# Altium schematic sheet CLK_PWR.SchDoc: My title
size A3; Organization: University of California; Address1: 475 Portola Plaza; Address2: Los Angeles, CA 90095; DocumentNumber: 12; Revision: R01; SheetNumber: 12; SheetTotal: 35
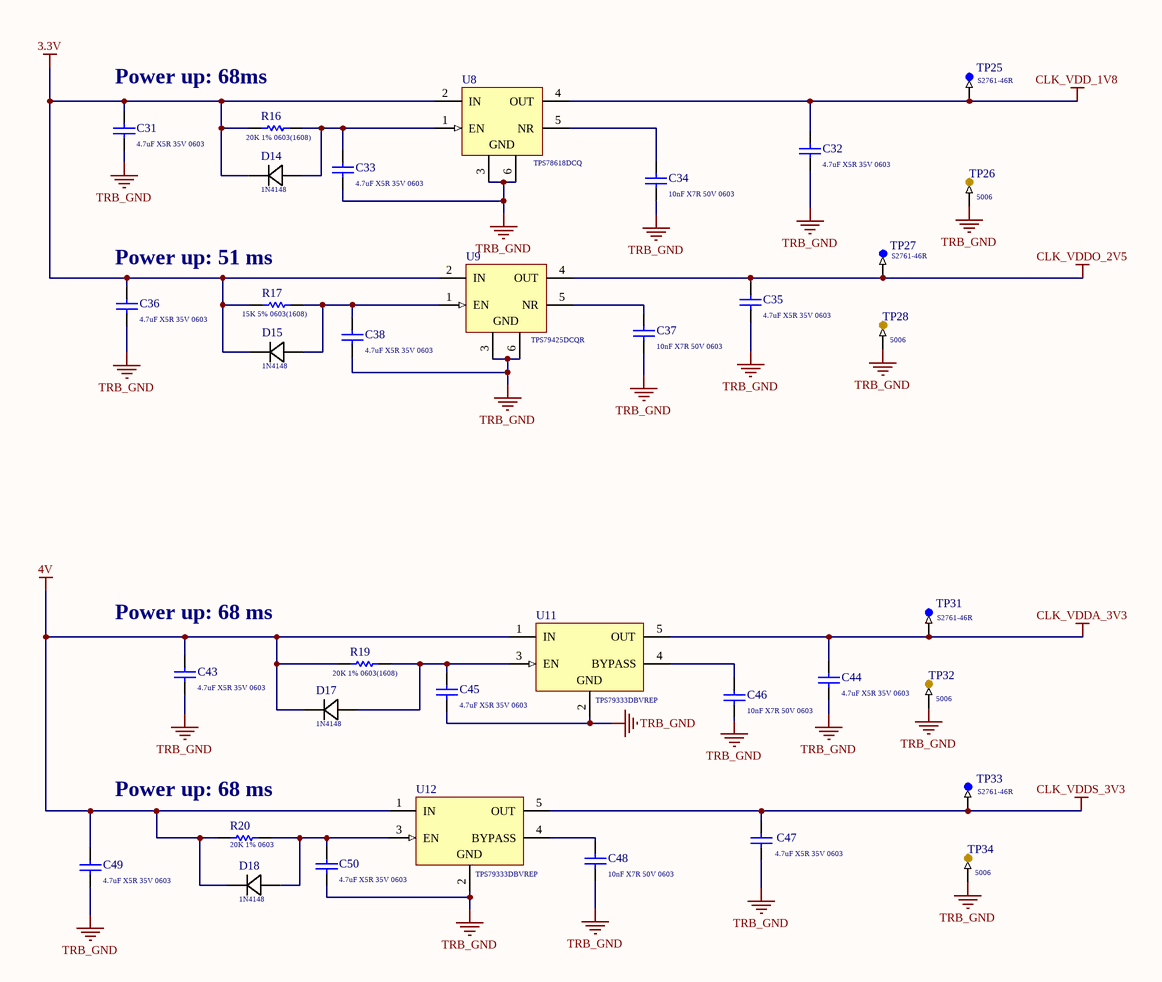
[diagram p0: CLK_PWR.SchDoc]

## Parts
C31  Capacitance: 4.7uF X5R 35V 0603  [Cap_Murata_ZRB18AR6YA475ME05L_4.7uF]  (hidden comment: Cap_Murata_ZRB18AR6YA475ME05L_4.7uF)
C32  Capacitance: 4.7uF X5R 35V 0603  [Cap_Murata_ZRB18AR6YA475ME05L_4.7uF]  (hidden comment: Cap_Murata_ZRB18AR6YA475ME05L_4.7uF)
C33  Capacitance: 4.7uF X5R 35V 0603  [Cap_Murata_ZRB18AR6YA475ME05L_4.7uF]  (hidden comment: Cap_Murata_ZRB18AR6YA475ME05L_4.7uF)
C34  Capacitance: 10nF X7R 50V 0603  [Kemet_C0603_0]  (hidden comment: Cap_Kemet_C0603C103J5RACTU_eec)
C35  Capacitance: 4.7uF X5R 35V 0603  [Cap_Murata_ZRB18AR6YA475ME05L_4.7uF]  (hidden comment: Cap_Murata_ZRB18AR6YA475ME05L_4.7uF)
C36  Capacitance: 4.7uF X5R 35V 0603  [Cap_Murata_ZRB18AR6YA475ME05L_4.7uF]  (hidden comment: Cap_Murata_ZRB18AR6YA475ME05L_4.7uF)
C37  Capacitance: 10nF X7R 50V 0603  [Kemet_C0603_0]  (hidden comment: Cap_Kemet_C0603C103J5RACTU_eec)
C38  Capacitance: 4.7uF X5R 35V 0603  [Cap_Murata_ZRB18AR6YA475ME05L_4.7uF]  (hidden comment: Cap_Murata_ZRB18AR6YA475ME05L_4.7uF)
C43  Capacitance: 4.7uF X5R 35V 0603  [Cap_Murata_ZRB18AR6YA475ME05L_4.7uF]  (hidden comment: Cap_Murata_ZRB18AR6YA475ME05L_4.7uF)
C44  Capacitance: 4.7uF X5R 35V 0603  [Cap_Murata_ZRB18AR6YA475ME05L_4.7uF]  (hidden comment: Cap_Murata_ZRB18AR6YA475ME05L_4.7uF)
C45  Capacitance: 4.7uF X5R 35V 0603  [Cap_Murata_ZRB18AR6YA475ME05L_4.7uF]  (hidden comment: Cap_Murata_ZRB18AR6YA475ME05L_4.7uF)
C46  Capacitance: 10nF X7R 50V 0603  [Kemet_C0603_0]  (hidden comment: Cap_Kemet_C0603C103J5RACTU_eec)
C47  Capacitance: 4.7uF X5R 35V 0603  [Cap_Murata_ZRB18AR6YA475ME05L_4.7uF]  (hidden comment: Cap_Murata_ZRB18AR6YA475ME05L_4.7uF)
C48  Capacitance: 10nF X7R 50V 0603  [Kemet_C0603_0]  (hidden comment: Cap_Kemet_C0603C103J5RACTU_eec)
C49  Capacitance: 4.7uF X5R 35V 0603  [Cap_Murata_ZRB18AR6YA475ME05L_4.7uF]  (hidden comment: Cap_Murata_ZRB18AR6YA475ME05L_4.7uF)
C50  Capacitance: 4.7uF X5R 35V 0603  [Cap_Murata_ZRB18AR6YA475ME05L_4.7uF]  (hidden comment: Cap_Murata_ZRB18AR6YA475ME05L_4.7uF)
D14  Series: 1N4148  [Diode_ON_Semiconductor_1N4148WT_300mA]  (hidden comment: Diode_ON_Semiconductor_1N4148WT_300mA)
D15  Series: 1N4148  [Diode_ON_Semiconductor_1N4148WT_300mA]  (hidden comment: Diode_ON_Semiconductor_1N4148WT_300mA)
D17  Series: 1N4148  [Diode_ON_Semiconductor_1N4148WT_300mA]  (hidden comment: Diode_ON_Semiconductor_1N4148WT_300mA)
D18  Series: 1N4148  [Diode_ON_Semiconductor_1N4148WT_300mA]  (hidden comment: Diode_ON_Semiconductor_1N4148WT_300mA)
R16  20K 1% 0603(1608)  [RESC0603(1608)_M]
R17  15K 5% 0603(1608)  [RESC0603(1608)_M]
R19  20K 1% 0603(1608)  [RESC0603(1608)_M]
R20  20K 1% 0603  [RESC0603(1608)_M]
TP25  Series: S2761-46R  [TP_Harwin_S2761_46R]  (hidden comment: TP_Harwin_S2761_46R)
TP26  Series: 5006  [TP_Keystone_Electronics_5006]  (hidden comment: TP_Keystone_Electronics_5006)
TP27  Series: S2761-46R  [TP_Harwin_S2761_46R]  (hidden comment: TP_Harwin_S2761_46R)
TP28  Series: 5006  [TP_Keystone_Electronics_5006]  (hidden comment: TP_Keystone_Electronics_5006)
TP31  Series: S2761-46R  [TP_Harwin_S2761_46R]  (hidden comment: TP_Harwin_S2761_46R)
TP32  Series: 5006  [TP_Keystone_Electronics_5006]  (hidden comment: TP_Keystone_Electronics_5006)
TP33  Series: S2761-46R  [TP_Harwin_S2761_46R]  (hidden comment: TP_Harwin_S2761_46R)
TP34  Series: 5006  [TP_Keystone_Electronics_5006]  (hidden comment: TP_Keystone_Electronics_5006)
U8  TPS78618DCQ  [DCQ0006A_L]
U9  TPS79425DCQR  [DCQ0006A_L]
U11  TPS79333DBVREP  [DBV0005A_M]
U12  TPS79333DBVREP  [DBV0005A_M]

## Nets
3.3V: C31.2 C36.2 D14.1 D15.1 R16.1 R17.1 U8.2(IN) U9.2(IN)
4V: C43.2 C49.2 D17.1 D18.1 R19.1 R20.2 U11.1(IN) U12.1(IN)
CLK_VDD_1V8: C32.2 TP25.1 U8.4(OUT)
CLK_VDDA_3V3: C44.2 TP31.1 U11.5(OUT)
CLK_VDDO_2V5: C35.2 TP27.1 U9.4(OUT)
CLK_VDDS_3V3: C47.2 TP33.1 U12.5(OUT)
TRB_GND: C31.1 C32.1 C33.1 C34.2 C35.1 C36.1 C37.2 C38.1 C43.1 C44.1 C45.1 C46.2 C47.1 C48.2 C49.1 C50.1 TP26.1 TP28.1 TP32.1 TP34.1 U8.3(GND) U8.6(GND) U9.3(GND) U9.6(GND) U11.2(GND) U12.2(GND)
NetC33_2: C33.2 D14.2 R16.2 U8.1(EN)
NetC34_1: C34.1 U8.5(NR)
NetC37_1: C37.1 U9.5(NR)
NetC38_2: C38.2 D15.2 R17.2 U9.1(EN)
NetC45_2: C45.2 D17.2 R19.2 U11.3(EN)
NetC46_1: C46.1 U11.4(BYPASS)
NetC48_1: C48.1 U12.4(BYPASS)
NetC50_2: C50.2 D18.2 R20.1 U12.3(EN)

## Notes on the sheet
- Power up: 68ms
- Power up: 51 ms
- (near C43) Power up: 68 ms
- (near R20) Power up: 68 ms
- 475 Portola Plaza
- GAPS TOF
- igarcia91@g.ucla.edu
- Los Angeles, CA
- 310-825-0344
- Size:
- Date:
- Letter
- Revision:
- Time:
- Sheet
- of
- andrew.peck@cern.ch
- spq@ucla.edu
- File:

## Library data of the parts
C31-C33 C35 C36 C38 C43-C45 C47 C49 C50 = Cap_Murata_ZRB18AR6YA475ME05L_4.7uF: CAP CER 4.7uF 35V X5R 0603; Supplier 1: Mouser; Supplier Part Number 1: 81-ZRB18AR6YA475ME5L
C34 C37 C46 C48 = Cap_Kemet_C0603C103J5RACTU_eec: CAP CER 10nF 50V X7R 0603; Manufacturer: Kemet; Mfg Package Ident: C0603; Part Number: C0603C103J5RACTU; helpURL: https://upverter.com/upn/revision/8a8d0c297e33ac74/; ComponentLink2Description: Datasheet; Temperature: -55°C to +125°C; Package: C0603; Supplier 2: Mouser; Price: 0.0184203126773; Supplier 1: Digi-Key; ComponentLink1URL: https://upverter.com/upn/revision/8a8d0c297e33ac74/; Supplier Part Number 2: 80-C0603C103J5R; Supplier Part Number 1: 399-1092-1-ND; Value: 10nF; ComponentLink1Description: Upverter; ComponentLink2URL: https://content.kemet.com/datasheets/KEM_C1002_X7R_SMD.pdf; RoHS: TRUE; Mouser Part Number: 80-C0603C103J5R; Temperature Range High: +125°C; Digikey Description: CAP CER 10000PF 50V X7R 0603; Digikey Part Number: 399-1092-1-ND; Lead Free: yes; Temperature Range Low: -55°C; Voltage: 50V
D14 D15 D17 D18 = Diode_ON_Semiconductor_1N4148WT_300mA: Diodes - General Purpose, Power, Switching SINGLE JUNC. 75V 4.0NS COMP; Supplier 1: Mouser; Supplier Part Number 1: 512-1N4148WT
R16 = CMP-1012-00655-1: 20K 0.1W 1% 0603 (1608 Metric)  SMD; Value: 20000.00 Ohm; Case-Metric: 1608; Case-EIA: 0603; Power: 0.1 W; Technology: SMT; Tolerance: 1 %
R17 = CMP-1012-00102-1: 15K 0.1W 5% 0603 (1608 Metric)  SMD; Value: 15000.00 Ohm; Case-EIA: 0603; Case-Metric: 1608; Tolerance: 5 %; Technology: SMT; Power: 0.1 W
R19 R20 = CMP-1012-00655-1: 20K 0.1W 1% 0603 (1608 Metric)  SMD; Case-Metric: 1608; Case-EIA: 0603; Value: 20000.00 Ohm; Technology: SMT; Power: 0.1 W; Tolerance: 1 %
TP25 TP27 TP31 TP33 = TP_Harwin_S2761_46R: Circuit Board Hardware - PCB SMT Mini Test Terminal, Reel; Supplier 1: Newark; Supplier Part Number 1: 76Y5391
TP26 TP28 TP32 TP34 = TP_Keystone_Electronics_5006: Circuit Board Hardware - PCB TEST POINT BLK .063; Supplier 1: Mouser; Supplier Part Number 1: 534-5006
U8 = CMP-0395-00376-2: Single Output High PSRR LDO, 1.5 A, Fixed 1.8 V Output, 2.7 to 5.5 V Input, 6-pin SOT-223 (DCQ), -40 to 125 degC, Green (RoHS & no Sb/Br); Manufacturer: Texas Instruments; Accuracy(%): 3; Fixed Output Options(V): 1.8; Vin(Min)(V): 2.7; SubFamily: Single Channel LDO; Vdo(Typ)(mV): 390; Vin(Max)(V): 5.5; Iout(Max)(A): 1.5; Iq(Typ)(mA): 0.2; Vout Adj(Min)(V): 1.8; ComponentLink3Description: Package Specification; PackageReference: DCQ0006A; ComponentLink3URL: http://www.ti.com/litv/pdf/mpds098c; ComponentLink1Description: Manufacturer URL; DatasheetVersion: SLVS389L; PackageDescription: 6-Pin Plastic Small Outline, Body 3.5 x 6.5 mm, Pitch 1.27 mm; Vout Adj(Max)(V): 1.8; ComponentLink1URL: http://www.ti.com/; Eco-Plan: Green (RoHS & no Sb/Br); Mounting Technology: Surface Mount; PartNumber: TPS78618DCQ; PackageVersion: 4202109/D; ComponentLink2URL: http://www.ti.com/general/docs/lit/getliterature.tsp?genericPartNumber=TPS78618&fileType=pdf; ComponentLink2Description: Datasheet
U9 = CMP-0394-00936-2: Single Output High PSRR LDO, 250 mA, Fixed 2.5 V Output, 2.7 to 5.5 V Input, 6-pin SOT-223 (DCQ), -40 to 85 degC, Green (RoHS & no Sb/Br); Manufacturer: Texas Instruments; SubFamily: Single Channel LDO; Iout(Max)(A): 0.25; Vin(Max)(V): 5.5; Vin(Min)(V): 2.7; Fixed Output Options(V): 2.5; Vdo(Typ)(mV): 155; Iq(Typ)(mA): 0.26; Accuracy(%): 3; ComponentLink3Description: Package Specification; Mounting Technology: Surface Mount; ComponentLink1URL: http://www.ti.com/; PackageVersion: 4202109/D; ComponentLink2URL: http://www.ti.com/general/docs/lit/getliterature.tsp?genericPartNumber=TPS79425&fileType=pdf; DatasheetVersion: SLVS349E; Eco-Plan: Green (RoHS & no Sb/Br); PackageReference: DCQ0006A; PackageDescription: 6-Pin Plastic Small Outline, Body 3.5 x 6.5 mm, Pitch 1.27 mm; Vout Adj(Min)(V): 2.5; ComponentLink1Description: Manufacturer URL; Vout Adj(Max)(V): 2.5; ComponentLink3URL: http://www.ti.com/litv/pdf/mpds098c; ComponentLink2Description: Datasheet; PartNumber: TPS79425DCQR
U11 U12 = CMP-0394-00316-2: Single Output Fast RF LDO, 200 mA, Fixed 3.3 V Output, 2.7 to 5.5 V Input, 5-pin SOT-23 (DBV), -40 to 125 degC, Green (RoHS & no Sb/Br); Manufacturer: Texas Instruments; Accuracy(%): 2; SubFamily: Single Channel LDO; Vin(Max)(V): 5.5; Fixed Output Options(V): 3.3; Vdo(Typ)(mV): 102; Iout(Max)(A): 0.2; Rating: HiRel Enhanced Product; Vin(Min)(V): 2.7; DatasheetVersion: SGLS163B; PackageVersion: 4073253-4/K; Code_JEDEC: MO-178; PackageDescription: 5-Pin Plastic Small Outline, Body 1.60 Ãƒâ€” 2.90 mm, Pitch 0.95 mm; ComponentLink1Description: Manufacturer URL; ComponentLink1URL: http://www.ti.com/; ComponentLink2Description: Datasheet; ComponentLink2URL: http://www.ti.com/general/docs/lit/getliterature.tsp?genericPartNumber=TPS79333-EP&fileType=pdf; ComponentLink3URL: http://www.ti.com/litv/pdf/mpds018i; Mounting Technology: Surface Mount; PartNumber: TPS79333DBVREP; Vout Adj(Min)(V): 3.3; PackageReference: DBV0005A; Iq(Typ)(mA): 0.2; Vout Adj(Max)(V): 3.3; Eco-Plan: Green (RoHS & no Sb/Br); ComponentLink3Description: Package Specification